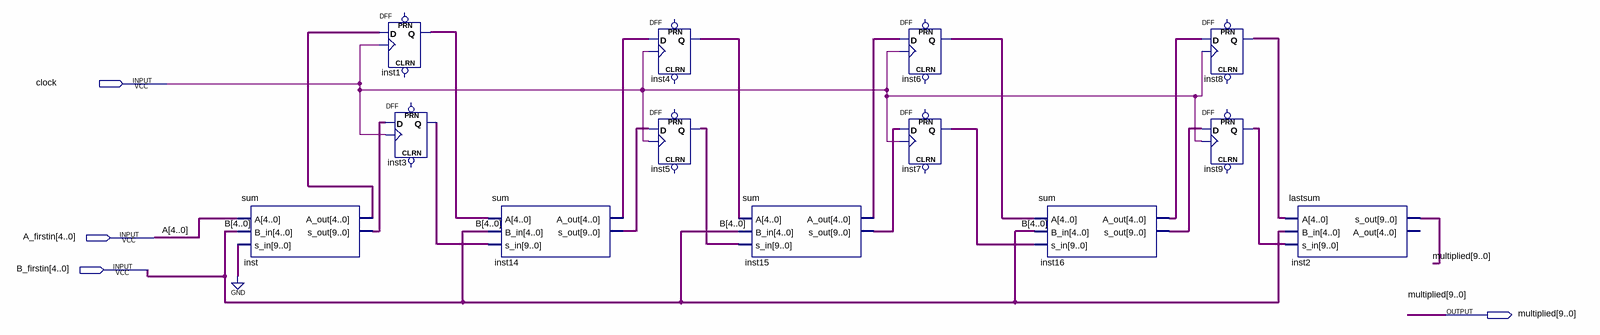
[diagram p0: schematic sheet]
// Quartus schematic pipelinedmultiplier.bdf as structural Verilog: 13 symbols, 4 pins
module pipelinedmultiplier (
  input  clock,
  input  [4:0] A_firstin,
  input  [4:0] B_firstin,
  output [9:0] multiplied
);

  wire [4:0] inst1_q, inst4_q, inst6_q, inst8_q, inst14_a_out, inst15_a_out, inst16_a_out, inst_a_out;
  wire [9:0] inst3_q, inst5_q, inst7_q, inst9_q, inst14_s_out, inst15_s_out, inst16_s_out, inst_s_out;

  sum inst (.A(A_firstin), .B_in(B_firstin), .s_in({10{1'b0}}), .A_out(inst_a_out), .s_out(inst_s_out));
  DFF inst1[4:0] (.CLK(clock), .D(inst_a_out), .Q(inst1_q));  // open: CLRN, PRN
  DFF inst3[9:0] (.CLK(clock), .D(inst_s_out), .Q(inst3_q));  // open: CLRN, PRN
  sum inst14 (.A(inst1_q), .B_in(B_firstin), .s_in(inst3_q), .A_out(inst14_a_out), .s_out(inst14_s_out));
  DFF inst4[4:0] (.CLK(clock), .D(inst14_a_out), .Q(inst4_q));  // open: CLRN, PRN
  DFF inst5[9:0] (.CLK(clock), .D(inst14_s_out), .Q(inst5_q));  // open: CLRN, PRN
  sum inst15 (.A(inst4_q), .B_in(B_firstin), .s_in(inst5_q), .A_out(inst15_a_out), .s_out(inst15_s_out));
  DFF inst6[4:0] (.CLK(clock), .D(inst15_a_out), .Q(inst6_q));  // open: CLRN, PRN
  DFF inst7[9:0] (.CLK(clock), .D(inst15_s_out), .Q(inst7_q));  // open: CLRN, PRN
  sum inst16 (.A(inst6_q), .B_in(B_firstin), .s_in(inst7_q), .A_out(inst16_a_out), .s_out(inst16_s_out));
  DFF inst8[4:0] (.CLK(clock), .D(inst16_a_out), .Q(inst8_q));  // open: CLRN, PRN
  DFF inst9[9:0] (.CLK(clock), .D(inst16_s_out), .Q(inst9_q));  // open: CLRN, PRN
  lastsum inst2 (.A(inst8_q), .B_in(B_firstin), .s_in(inst9_q), .s_out(multiplied));  // open: A_out

  // Other names for the same wires on the sheet: A[4:0] = A_firstin; B[4:0] = B_firstin
endmodule
